# Altium schematic sheet USB_HUB_4 Port.SchDoc
size A3
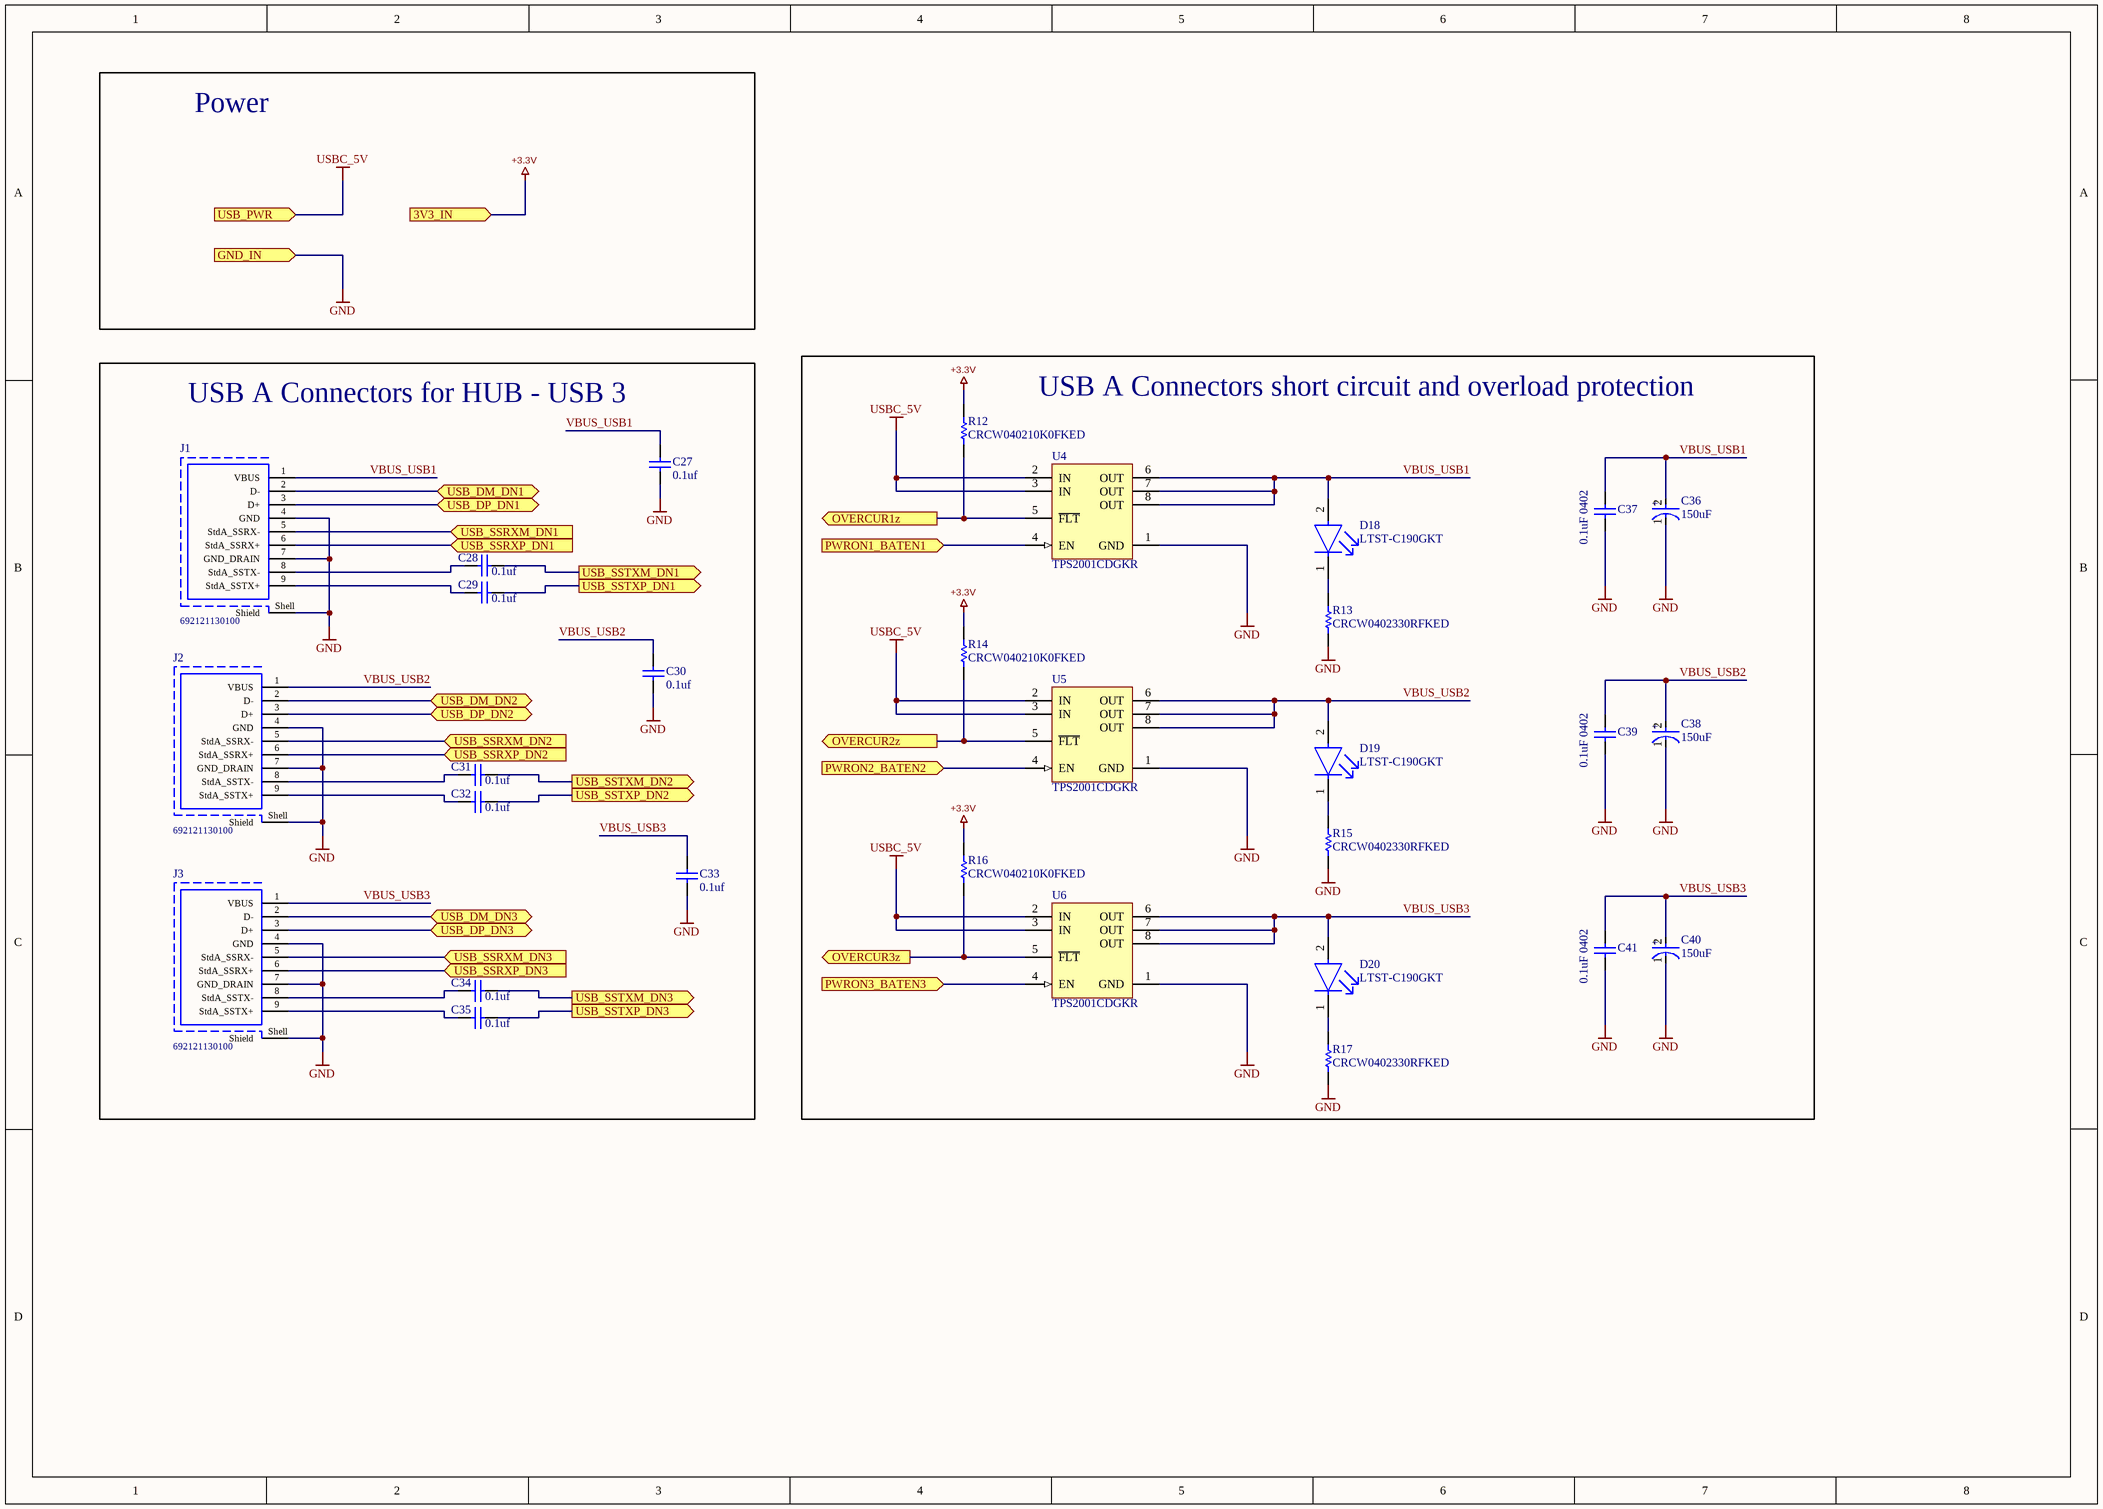
[diagram p0: USB_HUB_4 Port.SchDoc]

## Parts
C27  0.1uf  [CAPC1005X55X30ML05T10]
C28  0.1uf  [CAPC1005X55X30ML05T10]
C29  0.1uf  [CAPC1005X55X30ML05T10]
C30  0.1uf  [CAPC1005X55X30ML05T10]
C31  0.1uf  [CAPC1005X55X30ML05T10]
C32  0.1uf  [CAPC1005X55X30ML05T10]
C33  0.1uf  [CAPC1005X55X30ML05T10]
C34  0.1uf  [CAPC1005X55X30ML05T10]
C35  0.1uf  [CAPC1005X55X30ML05T10]
C36  150uF  [FP-SVPEB6-MFG]
C37  0.1uF 0402  [CAPC1005X55X30ML05T10]
C38  150uF  [FP-SVPEB6-MFG]
C39  0.1uF 0402  [CAPC1005X55X30ML05T10]
C40  150uF  [FP-SVPEB6-MFG]
C41  0.1uF 0402  [CAPC1005X55X30ML05T10]
D18  LTST-C190GKT  [FP-LTST-C190GKT-MFG]
D19  LTST-C190GKT  [FP-LTST-C190GKT-MFG]
D20  LTST-C190GKT  [FP-LTST-C190GKT-MFG]
J1  692121130100  [692121130100]
J2  692121130100  [692121130100]
J3  692121130100  [692121130100]
R12  CRCW040210K0FKED  [RESC1005X40X25NL05T05]
R13  CRCW0402330RFKED  [RESC1005X40X25NL05T05]
R14  CRCW040210K0FKED  [RESC1005X40X25NL05T05]
R15  CRCW0402330RFKED  [RESC1005X40X25NL05T05]
R16  CRCW040210K0FKED  [RESC1005X40X25NL05T05]
R17  CRCW0402330RFKED  [RESC1005X40X25NL05T05]
U4  TPS2001CDGKR  [DGK0008A_L]
U5  TPS2001CDGKR  [DGK0008A_L]
U6  TPS2001CDGKR  [DGK0008A_L]

## Blocks framed on the sheet
USB A Connectors for HUB - USB 3: C27-C35 J1-J3
USB A Connectors short circuit and overload protection: C36-C41 D18-D20 R12-R17 U4-U6

## Ports
3V3_IN (in), GND_IN (in), OVERCUR1z (out), OVERCUR2z (out), OVERCUR3z (out), PWRON1_BATEN1 (in), PWRON2_BATEN2 (in), PWRON3_BATEN3 (in), USB_DM_DN1 (bidir), USB_DM_DN2 (bidir), USB_DM_DN3 (bidir), USB_DP_DN1 (bidir), USB_DP_DN2 (bidir), USB_DP_DN3 (bidir), USB_PWR (in), USB_SSRXM_DN1 (in), USB_SSRXM_DN2 (in), USB_SSRXM_DN3 (in), USB_SSRXP_DN1 (in), USB_SSRXP_DN2 (in), USB_SSRXP_DN3 (in), USB_SSTXM_DN1 (out), USB_SSTXM_DN2 (out), USB_SSTXM_DN3 (out), USB_SSTXP_DN1 (out), USB_SSTXP_DN2 (out), USB_SSTXP_DN3 (out)

## Nets
+3.3V: R12.2 R14.2 R16.2 ; port 3V3_IN
GND: C27.1 C30.1 C33.1 C36.1(C) C37.1 C38.1(C) C39.1 C40.1(C) C41.1 J1.4(GND) J1.7(GND_DRAIN) J1.Shell(Shield) J2.4(GND) J2.7(GND_DRAIN) J2.Shell(Shield) J3.4(GND) J3.7(GND_DRAIN) J3.Shell(Shield) R13.1 R15.1 R17.1 U4.1(GND) U5.1(GND) U6.1(GND) ; port GND_IN
USBC_5V: U4.2(IN) U4.3(IN) U5.2(IN) U5.3(IN) U6.2(IN) U6.3(IN) ; port USB_PWR
OVERCUR1z: R12.1 U4.5(~{FLT}) ; port OVERCUR1z
OVERCUR2z: R14.1 U5.5(~{FLT}) ; port OVERCUR2z
OVERCUR3z: R16.1 U6.5(~{FLT}) ; port OVERCUR3z
PWRON1_BATEN1: U4.4(EN) ; port PWRON1_BATEN1
PWRON2_BATEN2: U5.4(EN) ; port PWRON2_BATEN2
PWRON3_BATEN3: U6.4(EN) ; port PWRON3_BATEN3
USB_DM_DN1: J1.2(D-) ; port USB_DM_DN1
USB_DM_DN2: J2.2(D-) ; port USB_DM_DN2
USB_DM_DN3: J3.2(D-) ; port USB_DM_DN3
USB_DP_DN1: J1.3(D+) ; port USB_DP_DN1
USB_DP_DN2: J2.3(D+) ; port USB_DP_DN2
USB_DP_DN3: J3.3(D+) ; port USB_DP_DN3
USB_SSRXM_DN1: J1.5(StdA_SSRX-) ; port USB_SSRXM_DN1
USB_SSRXM_DN2: J2.5(StdA_SSRX-) ; port USB_SSRXM_DN2
USB_SSRXM_DN3: J3.5(StdA_SSRX-) ; port USB_SSRXM_DN3
USB_SSRXP_DN1: J1.6(StdA_SSRX+) ; port USB_SSRXP_DN1
USB_SSRXP_DN2: J2.6(StdA_SSRX+) ; port USB_SSRXP_DN2
USB_SSRXP_DN3: J3.6(StdA_SSRX+) ; port USB_SSRXP_DN3
USB_SSTXM_DN1: C28.2 ; port USB_SSTXM_DN1
USB_SSTXM_DN2: C31.2 ; port USB_SSTXM_DN2
USB_SSTXM_DN3: C34.2 ; port USB_SSTXM_DN3
USB_SSTXP_DN1: C29.2 ; port USB_SSTXP_DN1
USB_SSTXP_DN2: C32.2 ; port USB_SSTXP_DN2
USB_SSTXP_DN3: C35.2 ; port USB_SSTXP_DN3
VBUS_USB1: C27.2 C36.2(A) C37.2 D18.2(A) J1.1(VBUS) U4.6(OUT) U4.7(OUT) U4.8(OUT)
VBUS_USB2: C30.2 C38.2(A) C39.2 D19.2(A) J2.1(VBUS) U5.6(OUT) U5.7(OUT) U5.8(OUT)
VBUS_USB3: C33.2 C40.2(A) C41.2 D20.2(A) J3.1(VBUS) U6.6(OUT) U6.7(OUT) U6.8(OUT)
NetC28_1: C28.1 J1.8(StdA_SSTX-)
NetC29_1: C29.1 J1.9(StdA_SSTX+)
NetC31_1: C31.1 J2.8(StdA_SSTX-)
NetC32_1: C32.1 J2.9(StdA_SSTX+)
NetC34_1: C34.1 J3.8(StdA_SSTX-)
NetC35_1: C35.1 J3.9(StdA_SSTX+)
NetD18_1: D18.1(C) R13.2
NetD19_1: D19.1(C) R15.2
NetD20_1: D20.1(C) R17.2

## Notes on the sheet
- Power
- Title
- Size:
- Date:
- A3
- Number:
- Time:
- Revision:
- Sheet
- of
- File:
- (in symbol CMP-05428-000017-1) +

## Library data of the parts
C27-C35 C37 C39 C41 = CMP-2008-03080-1: Manufacturer: Kemet; Part Number: C0402C104J4RACTU
C36 C38 C40 = CMP-05428-000017-1: CAP ALUM POLY 150UF 20% 6.3V SMD; Ripple Current: 3.52A; Life (Hours): 2000Hour; Leakage Current: 500uA; Dissipation Factor: 12%; Polarity: Polar; ESR (Equivalent Series Resistance): 12mR; Min Operating Temperature: -55°C; Height: 5.9mm; Lead Free: Lead Free; Case/Package: Radial; Length: 5.9mm; Tolerance: 20%; Packaging: Tape and Reel; Capacitance: 150uF; Max Operating Temperature: 105°C; Package Quantity: 1500; Ripple Current (AC): 3.52A; Voltage Rating: 6.3V; Height - Seated (Max): 0.236inch; REACH SVHC: No SVHC; Number of Pins: 6; Voltage Rating (DC): 6.3V; Mount: Surface Mount; Voltage: 6.3V; Termination: SMD/SMT; Diameter: 5mm
D18-D20 = CMP-22017-000005-1: LED GREEN CLEAR CHIP SMD; Reverse Voltage: 5V; Power Dissipation: 100mW; Forward Voltage: 2.1V; Test Current: 10mA; Number of LEDs: 1; Viewing Angle: 130°; Forward Current: 30mA; Voltage: 2V; Wavelength: 565nm; Dominant Wavelength: 569nm; Luminous Intensity: 6mcd; Lens Color: Colorless; Packaging: Tape and Reel; Lens Transparency: Clear; Min Operating Temperature: -55°C; Case Code (Metric): 1608; Lens Style: Clear; Case/Package: 0603; Mount: Surface Mount; Package Quantity: 1; Height: 0.8mm; Illumination Color: Green; Radiation Hardening: No; Depth: 0.8mm; Number of Pins: 2; Max Operating Temperature: 85°C; Color: Green; Number of Elements: 1; Power Rating: 100mW; Case Code (Imperial): 0603; Width: 0.8mm; Length: 1.6mm; Lead Free: Lead Free
J1-J3 = CMP-1502-03218-1: USB 3.0 Type A Receptacle WR-COM, Reverse Horizontal, SMT / THT, with Clips, with 0.14 mm Offset; Manufacturer: Wurth Elektronik; Contact Resistance: 50mOhm; Rated Current: 0.25A; Working Voltage: 30VAC; Operating Temperature: -20to85degC; Packaging: TapeandReel; Datasheet URL: https://katalog.we-online.de/em/datasheet/692121130100.pdf; Orientation: ReverseHorizontal; Gender: Receptacle; Package Reference: 692121130100; Connector Type: USB3.0TypeA; Publisher: WurthElektronik; Manufacturer URL: http://www.we-online.de; Part Number: 692121130100; Mounting Technology: SMT/THT
R12 R14 R16 = CMP-2002-08135-1: Manufacturer: Vishay Dale; Part Number: CRCW040210K0FKED
R13 R15 R17 = CMP-2002-08523-1: Manufacturer: Vishay Dale; Part Number: CRCW0402330RFKED
U4-U6 = CMP-0337-00297-2: Single Channel, Current-Limited USB Power Distribution Switch, 2.9 A Current Limit, -40 to 85 degC, 8-pin VSSOP (DGK), Green (RoHS & no Sb/Br); Manufacturer: Texas Instruments; Current Limit(A): 2.9; rDS(on) per FET(Typ)(mOhms): 70; Discharge Function: TRUE; Rating: Catalog; Number of Switches: 1; Continuous Current(Max)(A): 2; Vin(Max)(V): 5.5; Vin(Min)(V): 4.5; Enable: Active High; Mounting Technology: Surface Mount; Eco-Plan: Green (RoHS & no Sb/Br); PartNumber: TPS2001CDGKR; ComponentLink1URL: http://www.ti.com/general/docs/lit/getliterature.tsp?genericPartNumber=TPS2001C&fileType=pdf; PackageDescription: 8-Pin Thin Small Outline Package 3 x 3 mm Body ,0.65 mm Pitch; ComponentLink1Description: Datasheet; UL Listed: TRUE; PackageVersion: revE, May-2006; DatasheetVersion: SLVSAU6E; PackageReference: DGK0008A; Code_JEDEC: MO-187-AA